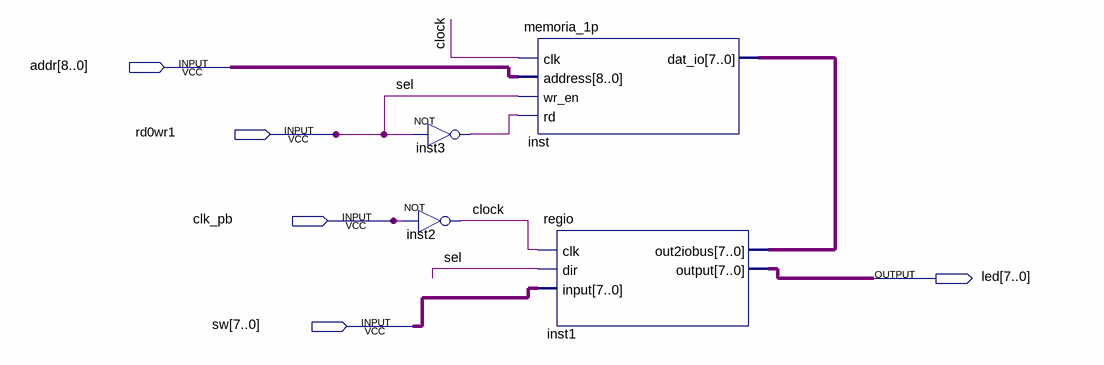
[diagram p0: schematic sheet]
// Quartus schematic Memoria.bdf as structural Verilog: 4 symbols, 5 pins
module Memoria (
  input  [8:0] addr,
  input  rd0wr1,
  input  clk_pb,
  input  [7:0] sw,
  output [7:0] led
);

  wire clock, inst3_out;
  wire [7:0] inst_dat_io;

  not inst3 (inst3_out, rd0wr1);
  not inst2 (clock, clk_pb);
  memoria_1p inst (.clk(clock), .address(addr), .wr_en(rd0wr1), .rd(inst3_out), .dat_io(inst_dat_io));
  regio inst1 (.clk(clock), .dir(rd0wr1), .\input (sw), .\output (led), .out2iobus(inst_dat_io));

  // Other names for the same wires on the sheet: sel = rd0wr1
endmodule
